# EAGLE schematic pbusRX8E (EAGLE 6.6.0)
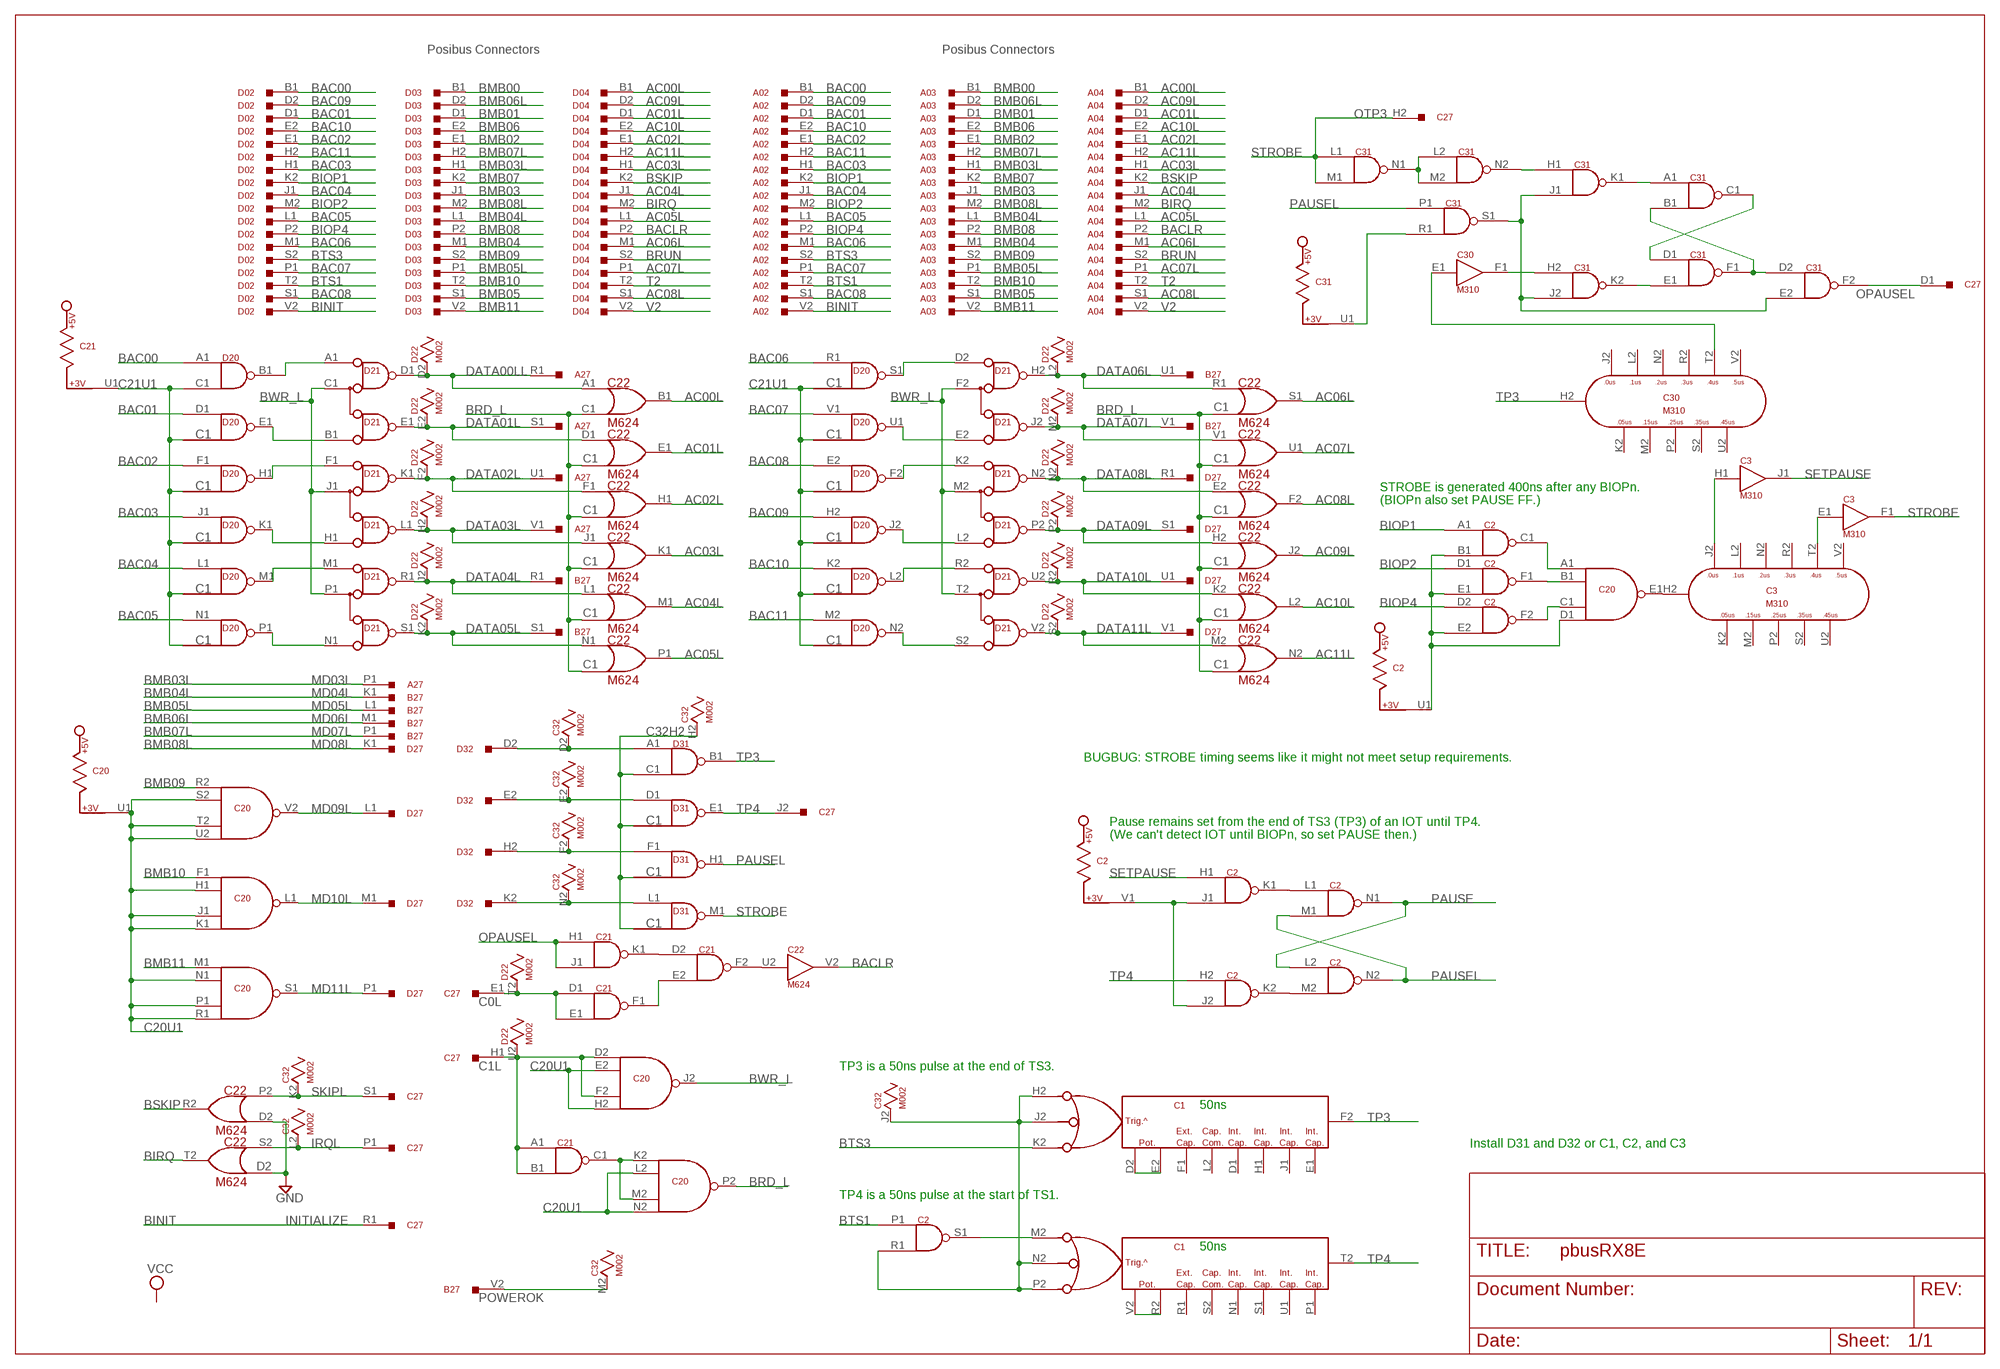
[diagram p0: schematic, sheet 1]

## Parts
A02  M903  [H807]
A03  M903  [H807]
A04  M903  [H807]
A27  M916  [H807]
B27  M916  [H807]
C1  M302  [H807]
C2  M113  [H807]
C3  M310  [H807]
C20  M617  [H807]
C21  M113  [H807]
C22  M624  [H807]
C27  M916  [H807]
C30  M310  [H807]
C31  M113  [H807]
C32  M002  [H807]
D02  M903  [H807]
D03  M903  [H807]
D04  M903  [H807]
D20  M101  [H807]
D21  M623  [H807]
D22  M002  [H807]
D27  M916  [H807]
D31  M101  [H807]
D32  M903  [H807]

## Nets
AC00L: A04.B1 C22.B1(B1:OUT) D04.B1
AC01L: A04.D1 C22.E1(E1:OUT) D04.D1
AC02L: A04.E1 C22.H1(H1:OUT) D04.E1
AC03L: A04.H1 C22.K1(K1:OUT) D04.H1
AC04L: A04.J1 C22.M1(M1:OUT) D04.J1
AC05L: A04.L1 C22.P1(P1:OUT) D04.L1
AC06L: A04.M1 C22.S1(S1:OUT) D04.M1
AC07L: A04.P1 C22.U1(U1:OUT) D04.P1
AC08L: A04.S1 C22.F2(F2:OUT) D04.S1
AC09L: A04.D2 C22.J2(J2:OUT) D04.D2
AC10L: A04.E2 C22.L2(L2:OUT) D04.E2
AC11L: A04.H2 C22.N2(N2:OUT) D04.H2
BAC00: A02.B1 D02.B1 D20.A1(B1:IN1)
BAC01: A02.D1 D02.D1 D20.D1(E1:IN)
BAC02: A02.E1 D02.E1 D20.F1(H1:IN)
BAC03: A02.H1 D02.H1 D20.J1(K1:IN)
BAC04: A02.J1 D02.J1 D20.L1(M1:IN)
BAC05: A02.L1 D02.L1 D20.N1(P1:IN)
BAC06: A02.M1 D02.M1 D20.R1(S1:IN)
BAC07: A02.P1 D02.P1 D20.V1(U1:IN)
BAC08: A02.S1 D02.S1 D20.E2(F2:IN)
BAC09: A02.D2 D02.D2 D20.H2(J2:IN)
BAC10: A02.E2 D02.E2 D20.K2(L2:IN)
BAC11: A02.H2 D02.H2 D20.M2(N2:IN)
BACLR: A04.P2 C22.V2(V2:OUT) D04.P2
BINIT: A02.V2 C27.R1 D02.V2
BIOP1: A02.K2 C2.A1(C1:IN1) D02.K2
BIOP2: A02.M2 C2.D1(F1:IN1) D02.M2
BIOP4: A02.P2 C2.D2(F2:IN1) D02.P2
BIRQ: A04.M2 C22.T2(T2:OUT) D04.M2
BMB00: A03.B1 D03.B1
BMB01: A03.D1 D03.D1
BMB02: A03.E1 D03.E1
BMB03: A03.J1 D03.J1
BMB03L: A03.H1 A27.P1 D03.H1
BMB04: A03.M1 D03.M1
BMB04L: A03.L1 B27.K1 D03.L1
BMB05: A03.S1 D03.S1
BMB05L: A03.P1 B27.L1 D03.P1
BMB06: A03.E2 D03.E2
BMB06L: A03.D2 B27.M1 D03.D2
BMB07: A03.K2 D03.K2
BMB07L: A03.H2 B27.P1 D03.H2
BMB08: A03.P2 D03.P2
BMB08L: A03.M2 D03.M2 D27.K1
BMB09: A03.S2 C20.R2(V2:IN1) D03.S2
BMB10: A03.T2 C20.F1(L1:IN1) D03.T2
BMB11: A03.V2 C20.M1(S1:IN1) D03.V2
BRD_L: C20.P2(P2:OUT) C22.C1(B1:IN2)
BRUN: A04.S2 D04.S2
BSKIP: A04.K2 C22.R2(R2:OUT) D04.K2
BTS1: A02.T2 C2.P1(S1:IN1) D02.T2
BTS3: A02.S2 C1.K2(F2:K2) D02.S2
BWR_L: C20.J2(J2:OUT) D21.C1(D1:C) D21.F2(H2:C) D21.J1(K1:C) D21.M2(N2:C) D21.P1(R1:C) D21.T2(U2:C)
C0L: C21.D1(F1:IN1) C21.E1(F1:IN2) C27.E1 D22.T2
C1L: C20.D2(J2:IN1) C20.F2(J2:IN3) C21.A1(C1:IN1) C21.B1(C1:IN2) C27.H1 D22.U2
C20U1: C20.E2(J2:IN2) C20.H1(L1:IN2) C20.H2(J2:IN4) C20.J1(L1:IN3) C20.K1(L1:IN4) C20.L2(P2:IN2) C20.N1(S1:IN2) C20.N2(P2:IN4) C20.P1(S1:IN3) C20.R1(S1:IN4) C20.S2(V2:IN2) C20.T2(V2:IN3) C20.U1 C20.U2(V2:IN4)
C21U1: C21.U1 D20.C1(B1:IN2)
C32H2: C32.H2 D31.C1(B1:IN2)
DATA00LL: A27.R1 C22.A1(B1:IN1) D21.D1(D1:D) D22.D2
DATA01L: A27.S1 C22.D1(E1:IN) D21.E1(D1:E) D22.E2
DATA02L: A27.U1 C22.F1(H1:IN) D21.K1(K1:D) D22.F2
DATA03L: A27.V1 C22.J1(K1:IN) D21.L1(K1:E) D22.H2
DATA04L: B27.R1 C22.L1(M1:IN) D21.R1(R1:D) D22.J2
DATA05L: B27.S1 C22.N1(P1:IN) D21.S1(R1:E) D22.K2
DATA06L: B27.U1 C22.R1(S1:IN) D21.H2(H2:D) D22.L2
DATA07L: B27.V1 C22.V1(U1:IN) D21.J2(H2:E) D22.M2
DATA08L: C22.E2(F2:IN) D21.N2(N2:D) D22.N2 D27.R1
DATA09L: C22.H2(J2:IN) D21.P2(N2:E) D22.P2 D27.S1
DATA10L: C22.K2(L2:IN) D21.U2(U2:D) D22.R2 D27.U1
DATA11L: C22.M2(N2:IN) D21.V2(U2:E) D22.S2 D27.V1
GND: C22.D2(R2:IN2)
IRQL: C22.S2(T2:IN) C27.P1 C32.L2
MD09L: C20.V2(V2:OUT) D27.L1
MD10L: C20.L1(L1:OUT) D27.M1
MD11L: C20.S1(S1:OUT) D27.P1
N$1: D20.B1(B1:OUT) D21.A1(D1:A)
N$2: D20.E1(E1:OUT) D21.B1(D1:B)
N$3: D20.H1(H1:OUT) D21.F1(K1:A)
N$4: D20.K1(K1:OUT) D21.H1(K1:B)
N$5: D20.P1(P1:OUT) D21.N1(R1:B)
N$6: D20.M1(M1:OUT) D21.M1(R1:A)
N$7: C20.K2(P2:IN1) C20.M2(P2:IN3) C21.C1(C1:OUT)
N$8: D20.N2(N2:OUT) D21.S2(U2:B)
N$9: C32.D2 D31.A1(B1:IN1) D32.D2
N$10: D20.J2(J2:OUT) D21.L2(N2:B)
N$11: D20.U1(U1:OUT) D21.E2(H2:B)
N$12: D20.S1(S1:OUT) D21.D2(H2:A)
N$13: D20.F2(F2:OUT) D21.K2(N2:A)
N$14: D20.L2(L2:OUT) D21.R2(U2:A)
N$15: C32.E2 D31.D1(E1:IN) D32.E2
N$16: C32.F2 D31.F1(H1:IN) D32.H2
N$17: C32.N2 D31.L1(M1:IN) D32.K2
N$18: C31.E2(F2:IN2) C31.J1(K1:IN2) C31.J2(K2:IN2) C31.S1(S1:OUT)
N$19: C21.E2(F2:IN2) C21.F1(F1:OUT)
N$20: C21.D2(F2:IN1) C21.K1(K1:OUT)
N$21: C31.C1(C1:OUT) C31.D1(F1:IN1)
N$22: C31.B1(C1:IN2) C31.D2(F2:IN1) C31.F1(F1:OUT)
N$23: C21.F2(F2:OUT) C22.U2(V2:IN)
N$24: C30.E1(F1:IN) C30.T2(H2:T2)
N$25: C30.F1(F1:OUT) C31.H2(K2:IN1)
N$26: C31.L2(N2:IN1) C31.M2(N2:IN2) C31.N1(N1:OUT)
N$27: C3.H2(H2:H2) C20.E1(E1:OUT)
N$28: C31.H1(K1:IN1) C31.N2(N2:OUT)
N$29: C31.A1(C1:IN1) C31.K1(K1:OUT)
N$30: C31.E1(F1:IN2) C31.K2(K2:OUT)
N$31: C3.E1(F1:IN) C3.T2(H2:T2)
N$32: C2.F2(F2:OUT) C20.C1(E1:IN3)
N$33: C2.C1(C1:OUT) C20.A1(E1:IN1)
N$34: C2.F1(F1:OUT) C20.B1(E1:IN2)
N$35: C1.D2(F2:D2) C1.E2(F2:E2)
N$36: C1.M2(T2:H2) C2.S1(S1:OUT)
N$37: C1.R2(T2:E2) C1.V2(T2:D2)
N$38: C3.H1(J1:IN) C3.J2(H2:J2)
N$39: C2.K1(K1:OUT) C2.L1(N1:IN1)
N$40: C1.H2(F2:H2) C1.J2(F2:J2) C1.N2(T2:J2) C1.P2(T2:K2) C2.R1(S1:IN2) C32.J2
N$41: C2.K2(K2:OUT) C2.M2(N2:IN2)
N$42: C31.R1(S1:IN2) C31.U1
N$43: C2.B1(C1:IN2) C2.E1(F1:IN2) C2.E2(F2:IN2) C2.U1 C20.D1(E1:IN4)
N$44: C2.J1(K1:IN2) C2.J2(K2:IN2) C2.V1
OPAUSEL: C21.H1(K1:IN1) C21.J1(K1:IN2) C27.D1 C31.F2(F2:OUT)
PAUSE: C2.L2(N2:IN1) C2.N1(N1:OUT)
PAUSEL: C2.M1(N1:IN2) C2.N2(N2:OUT) C31.P1(S1:IN1) D31.H1(H1:OUT)
POWEROK: B27.V2 C32.M2
SETPAUSE: C2.H1(K1:IN1) C3.J1(J1:OUT)
SKIPL: C22.P2(R2:IN1) C27.S1 C32.K2
STROBE: C3.F1(F1:OUT) C27.H2 C31.L1(N1:IN1) C31.M1(N1:IN2) D31.M1(M1:OUT)
T2: A04.T2 D04.T2
TP3: C1.F2(F2:F2) C30.H2(H2:H2) D31.B1(B1:OUT)
TP4: C1.T2(T2:F2) C2.H2(K2:IN1) C27.J2 D31.E1(E1:OUT)
V2: A04.V2 D04.V2
Unconnected: A27.A1 A27.A2 A27.B1 A27.B2 A27.C1 A27.C2 A27.D1 A27.D2 A27.E1 A27.E2 A27.F1 A27.F2 A27.H1 A27.H2 A27.J1 A27.J2 A27.K1 A27.K2 A27.L1 A27.L2 A27.M1 A27.M2 A27.N1 A27.N2 A27.P2 A27.R2 A27.S2 A27.T1 A27.T2 A27.U2 A27.V2 B27.A1 B27.A2 B27.B1 B27.B2 B27.C1 B27.C2 B27.D1 B27.D2 B27.E1 B27.E2 B27.F1 B27.F2 B27.H1 B27.H2 B27.J1 B27.J2 B27.K2 B27.L2 B27.M2 B27.N1 B27.N2 B27.P2 B27.R2 B27.S2 B27.T1 B27.T2 B27.U2 C1.D1(F2:D1) C1.E1(F2:E1) C1.F1(F2:F1) C1.H1(F2:H1) C1.J1(F2:J1) C1.L2(F2:L2) C1.N1(T2:D1) C1.P1(T2:E1) C1.R1(T2:F1) C1.S1(T2:H1) C1.S2(T2:L2) C1.U1(T2:J1) C2.P2(S2:IN1) C2.R2(S2:IN2) C2.S2(S2:OUT) C2.T2(V2:IN1) C2.U2(V2:IN2) C2.V2(V2:OUT) C3.K2(H2:K2) C3.L2(H2:L2) C3.M2(H2:M2) C3.N2(H2:N2) C3.P2(H2:P2) C3.R2(H2:R2) C3.S2(H2:S2) C3.U2(H2:U2) C3.V2(H2:V2) C20.V1 C21.H2(K2:IN1) C21.J2(K2:IN2) C21.K2(K2:OUT) C21.L1(N1:IN1) C21.L2(N2:IN1) C21.M1(N1:IN2) C21.M2(N2:IN2) C21.N1(N1:OUT) C21.N2(N2:OUT) C21.P1(S1:IN1) C21.P2(S2:IN1) C21.R1(S1:IN2) C21.R2(S2:IN2) C21.S1(S1:OUT) C21.S2(S2:OUT) C21.T2(V2:IN1) C21.U2(V2:IN2) C21.V1 C21.V2(V2:OUT) C27.A1 C27.A2 C27.B1 C27.B2 C27.C1 C27.C2 C27.D2 C27.E2 C27.F1 C27.F2 C27.J1 C27.K1 C27.K2 C27.L1 C27.L2 C27.M1 C27.M2 C27.N1 C27.N2 C27.P2 C27.R2 C27.S2 C27.T1 C27.T2 C27.U1 C27.U2 C27.V1 C27.V2 C30.H1(J1:IN) C30.J1(J1:OUT) C30.J2(H2:J2) C30.K2(H2:K2) C30.L2(H2:L2) C30.M2(H2:M2) C30.N2(H2:N2) C30.P2(H2:P2) C30.R2(H2:R2) C30.S2(H2:S2) C30.U2(H2:U2) C30.V2(H2:V2) C31.P2(S2:IN1) C31.R2(S2:IN2) C31.S2(S2:OUT) C31.T2(V2:IN1) C31.U2(V2:IN2) C31.V1 C31.V2(V2:OUT) C32.P2 C32.R2 C32.S2 C32.T2 C32.U2 C32.V2 D20.P2(R2:IN) D20.R2(R2:OUT) D20.S2(T2:IN) D20.T2(T2:OUT) D20.U2(V2:IN) D20.V2(V2:OUT) D22.V2 D27.A1 D27.A2 D27.B1 D27.B2 D27.C1 D27.C2 D27.D1 D27.D2 D27.E1 D27.E2 D27.F1 D27.F2 D27.H1 D27.H2 D27.J1 D27.J2 D27.K2 D27.L2 D27.M2 D27.N1 D27.N2 D27.P2 D27.R2 D27.S2 D27.T1 D27.T2 D27.U2 D27.V2 D31.E2(F2:IN) D31.F2(F2:OUT) D31.H2(J2:IN) D31.J1(K1:IN) D31.J2(J2:OUT) D31.K1(K1:OUT) D31.K2(L2:IN) D31.L2(L2:OUT) D31.M2(N2:IN) D31.N1(P1:IN) D31.N2(N2:OUT) D31.P1(P1:OUT) D31.P2(R2:IN) D31.R1(S1:IN) D31.R2(R2:OUT) D31.S1(S1:OUT) D31.S2(T2:IN) D31.T2(T2:OUT) D31.U1(U1:OUT) D31.U2(V2:IN) D31.V1(U1:IN) D31.V2(V2:OUT) D32.B1 D32.D1 D32.E1 D32.H1 D32.J1 D32.L1 D32.M1 D32.M2 D32.P1 D32.P2 D32.S1 D32.S2 D32.T2 D32.V2

## Notes on the sheet
- Posibus Connectors | Posibus Connectors
- OTP3
- STROBE is generated 400ns after any BIOPn.
- (BIOPn also set PAUSE FF.)
- MD03L
- MD04L
- MD05L
- MD06L
- MD07L
- MD08L
- BUGBUG: STROBE timing seems like it might not meet setup requirements.
- Pause remains set from the end of TS3 (TP3) of an IOT until TP4.
- (We can't detect IOT until BIOPn, so set PAUSE then.)
- TP3 is a 50ns pulse at the end of TS3.
- 50ns
- Install D31 and D32 or C1, C2, and C3
- TP4 is a 50ns pulse at the start of TS1.
- INITIALIZE
- 50ns

## Power pins joined to a net without a drawn wire
GND: A02.A1 A02.C1 A02.C2 A02.F1 A02.F2 A02.J2 A02.K1 A02.L2 A02.N1 A02.N2 A02.R1 A02.R2 A02.T1 A02.U2 A03.A1 A03.C1 A03.C2 A03.F1 A03.F2 A03.J2 A03.K1 A03.L2 A03.N1 A03.N2 A03.R1 A03.R2 A03.T1 A03.U2 A04.A1 A04.C1 A04.C2 A04.F1 A04.F2 A04.J2 A04.K1 A04.L2 A04.N1 A04.N2 A04.R1 A04.R2 A04.T1 A04.U2 C1.C2(GND) C1.T1(GND) C2.C2(GND) C2.T1(GND) C3.C2(GND) C3.T1(GND) C20.C2(GND) C20.T1(GND) C21.C2(GND) C21.T1(GND) C22.C2(GND) C22.T1(GND) C30.C2(GND) C30.T1(GND) C31.C2(GND) C31.T1(GND) C32.C2(GND) D02.A1 D02.C1 D02.C2 D02.F1 D02.F2 D02.J2 D02.K1 D02.L2 D02.N1 D02.N2 D02.R1 D02.R2 D02.T1 D02.U2 D03.A1 D03.C1 D03.C2 D03.F1 D03.F2 D03.J2 D03.K1 D03.L2 D03.N1 D03.N2 D03.R1 D03.R2 D03.T1 D03.U2 D04.A1 D04.C1 D04.C2 D04.F1 D04.F2 D04.J2 D04.K1 D04.L2 D04.N1 D04.N2 D04.R1 D04.R2 D04.T1 D04.U2 D20.C2(GND) D20.T1(GND) D21.C2(GND) D21.T1(GND) D21.U1(GND) D21.V1(GND) D22.C2(GND) D31.C2(GND) D31.T1(GND) D32.A1 D32.C1 D32.C2 D32.F1 D32.F2 D32.J2 D32.K1 D32.L2 D32.N1 D32.N2 D32.R1 D32.R2 D32.T1 D32.U2
VCC: C1.A2(VCC) C2.A2(VCC) C3.A2(VCC) C20.A2(VCC) C21.A2(VCC) C22.A2(VCC) C30.A2(VCC) C31.A2(VCC) C32.A2(VCC) D20.A2(VCC) D21.A2(VCC) D22.A2(VCC) D31.A2(VCC)

## Library data of the parts
A02-A04 D02-D04 D32 = dec-m:M903: Two-sided Posibus cable/connector.
A27 B27 C27 D27 = dec-m:M916: Simple 36 pin connector/wire cable
C1 = dec-m:M302: Dual one-shot
C2 C21 C31 = dec-m:M113: 10 2-input NAND Gates
C3 C30 = dec-m:M310: Tapped Delay Line
C20 = dec-m:M617: 6 4-input NAND Buffers
C22 = dec-m:M624: Bus Data Interface The M101 contains 15 two-input NAND gates. One input of each gate is tied to a common line so that all data signals can be enabled simultaneously. Each data signal presents one TTL load. The common input presents 15 loads. Each output can drive 10 loads. Power: 5V@82ma (max.)
C32 D22 = dec-m:M002: 15 Clamped Loads
D20 D31 = dec-m:M101: Bus Data Interface The M101 contains 15 two-input NAND gates. One input of each gate is tied to a common line so that all data signals can be enabled simultaneously. Each data signal presents one TTL load. The common input presents 15 loads. Each output can drive 10 loads. Power: 5V@82ma (max.)
D21 = dec-m:M623: 6 Dual Bus Drivers

## Net classes
1 Supply: width 1.905 mm, clearance 0.508 mm